# Altium schematic sheet Analog.SchDoc
size A
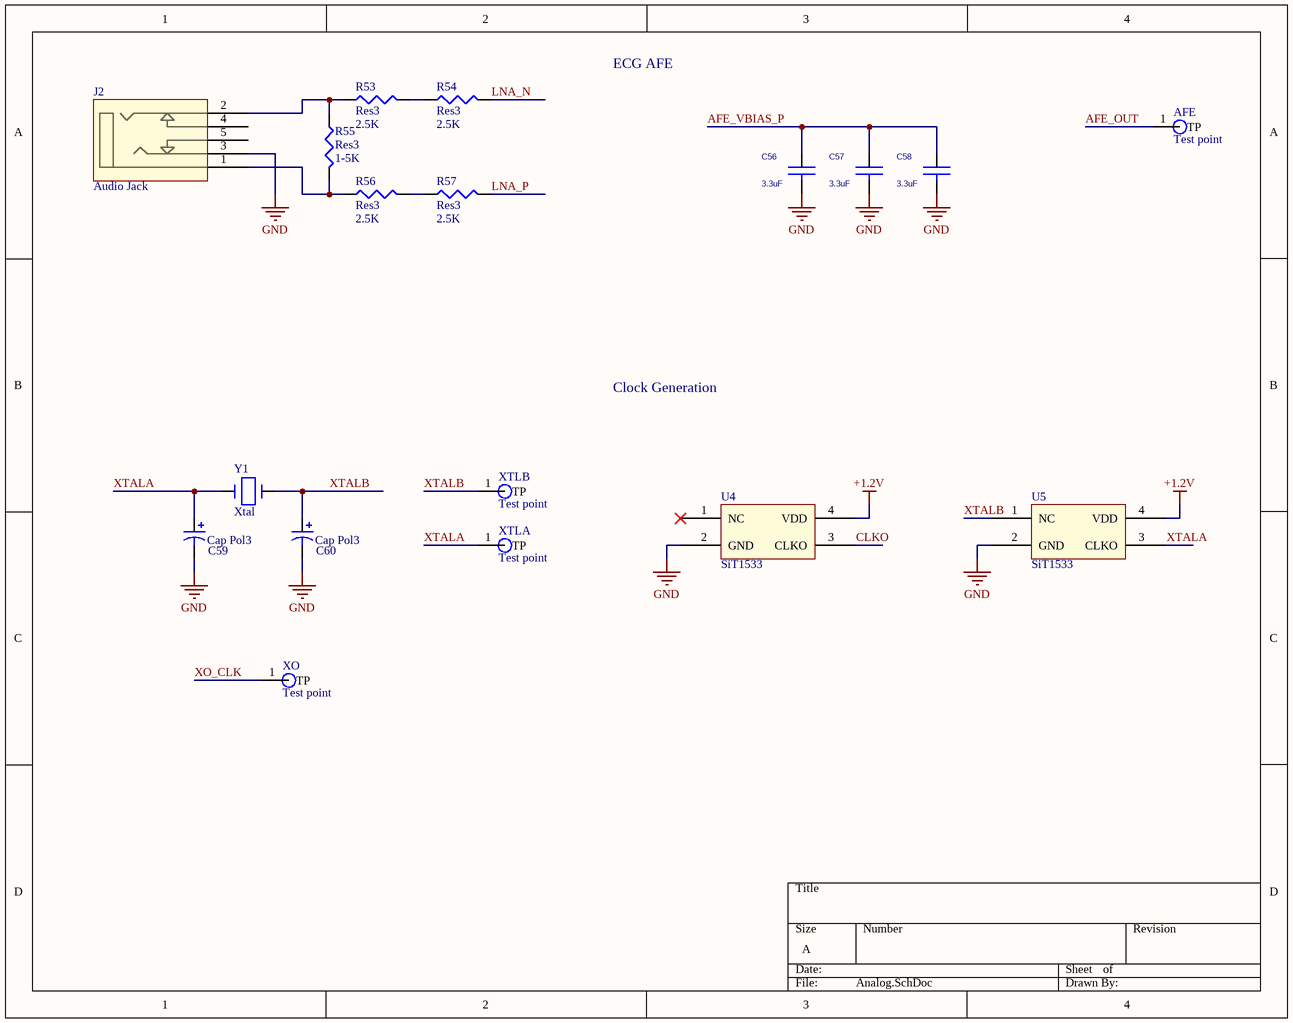
[diagram p0: Analog.SchDoc]

## Parts
AFE  Test point  [TP]
C56  3.3uF  [0402]
C57  3.3uF  [0402]
C58  3.3uF  [0402]
C59  Cap Pol3  [0402]
C60  Cap Pol3  [0402]
J2  Audio Jack  [Audio Jack]
R53  Res3  value 2.5K  [0402]
R54  Res3  value 2.5K  [0402]
R55  Res3  value 1-5K  [0402]
R56  Res3  value 2.5K  [0402]
R57  Res3  value 2.5K  [0402]
U4  SiT1533  [SiT1533]
U5  SiT1533  [SiT1533]
XO  Test point  [TP]
XTLA  Test point  [TP]
XTLB  Test point  [TP]
Y1  Xtal  [Xtal_C2]

## Nets
+1.2V: U4.4(VDD) U5.4(VDD)
GND: C56.2 C57.2 C58.2 C59.2 C60.2 J2.3 U4.2(GND) U5.2(GND)
AFE_OUT: AFE.1(TP)
AFE_VBIAS_P: C56.1 C57.1 C58.1
CLKO: U4.3(CLKO)
LNA_N: R54.2
LNA_P: R57.2
XO_CLK: XO.1(TP)
XTALA: C59.1 U5.3(CLKO) XTLA.1(TP) Y1.1
XTALB: C60.1 U5.1(NC) XTLB.1(TP) Y1.2
NetJ2_1: J2.1 R55.2 R56.1
NetJ2_2: J2.2 R53.1 R55.1
NetR53_2: R53.2 R54.1
NetR56_2: R56.2 R57.1

Not connected (* = marked no-connect by the designer): J2 4 5; U4 1(NC)*

## Notes on the sheet
- ECG AFE
- Clock Generation

## Library data of the parts
C56-C58 = C
C59 C60 = Cap Pol3: Polarized Capacitor (Surface Mount); Published: 8-Jun-2000; LatestRevisionDate: 29-May-2009; LatestRevisionNote: IPC-7351 Footprint Added.; PackageReference: C0805; Publisher: Altium Limited; PackageDescription: Chip Capacitor
R53-R57 = Res3: Resistor; Published: 8-Jun-2000; LatestRevisionDate: 29-May-2009; LatestRevisionNote: IPC-7351 Footprint Added.; PackageReference: J1-0603; Publisher: Altium Limited; PackageDescription: Chip Resistor
U4 U5 = SiT1533: Ultra-low Power 32KHz Oscillator